# EAGLE design AC relay board (EAGLE 6.5.0)
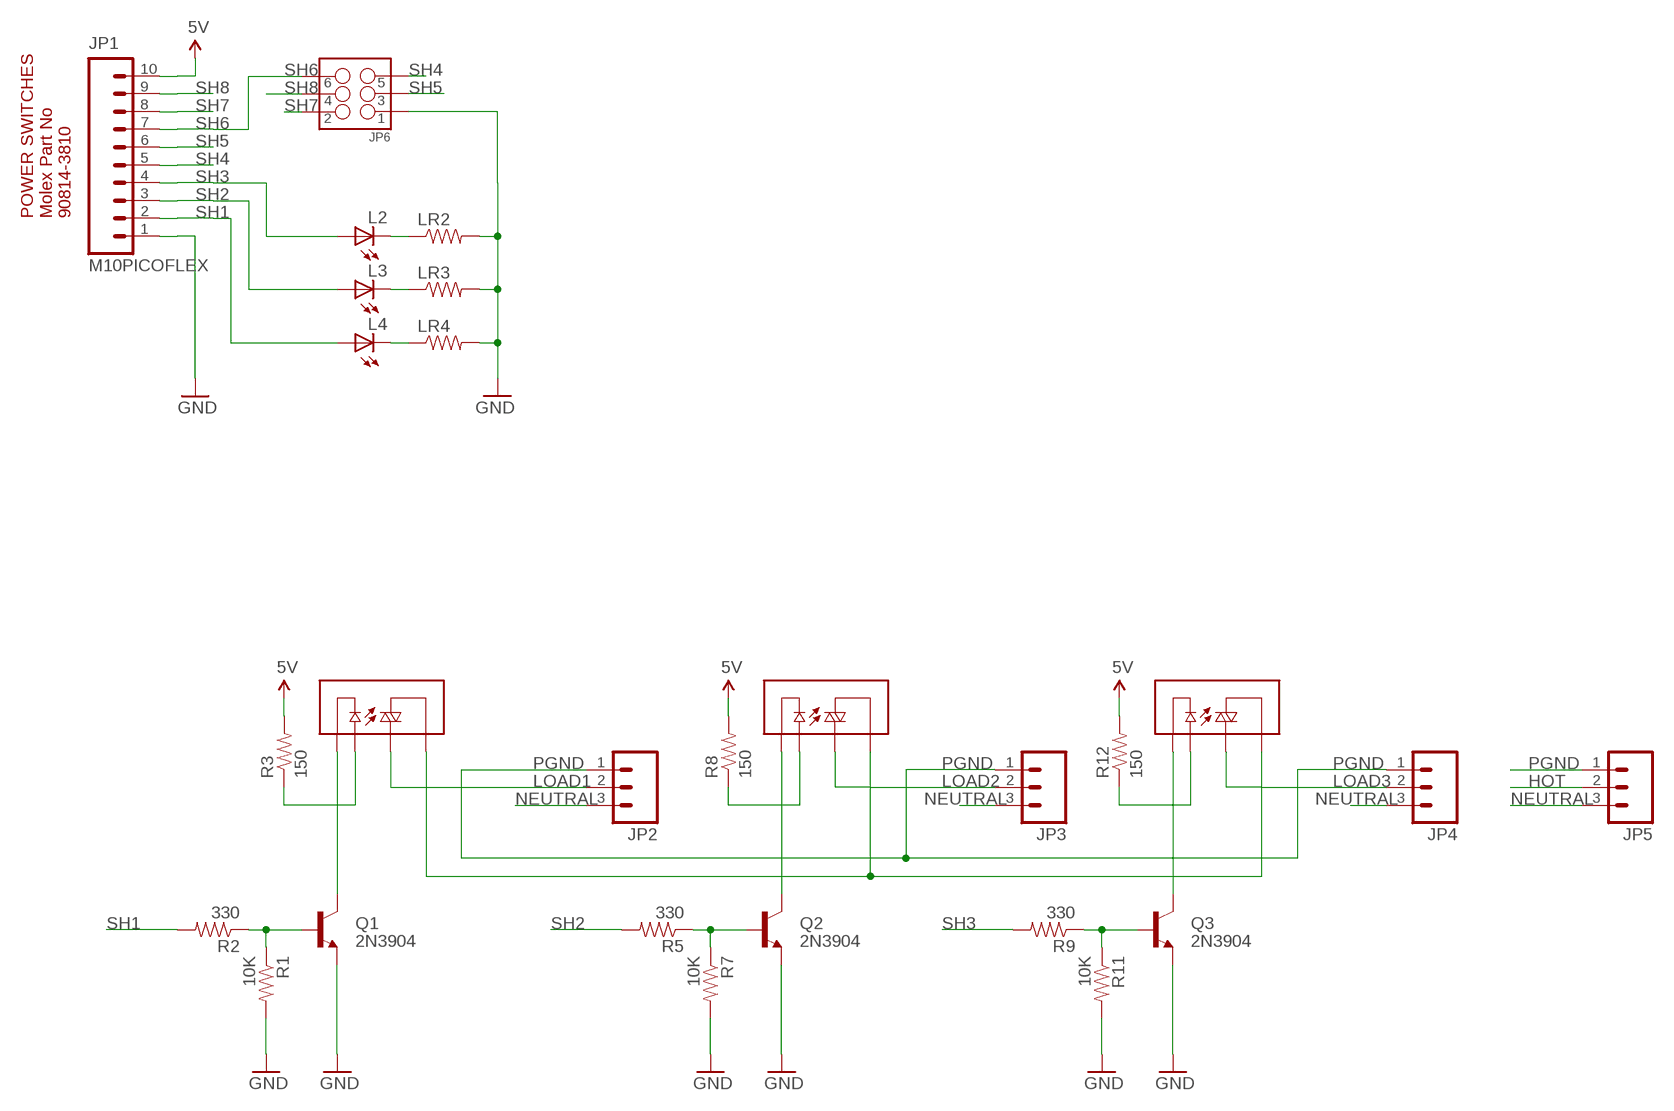
[diagram p0: schematic, sheet 1]

## Parts
JP1  M10PICOFLEX  [CONNECTOR_MOLEX_PICOFLEX_10]
JP2  M03SCREW_LOCK  [SCREWTERMINAL-3.5MM-3_LOCK.007S]
JP3  M03SCREW_LOCK  [SCREWTERMINAL-3.5MM-3_LOCK.007S]
JP4  M03SCREW_LOCK  [SCREWTERMINAL-3.5MM-3_LOCK.007S]
JP5  M03SCREW_LOCK  [SCREWTERMINAL-3.5MM-3_LOCK.007S]
JP6  M03X2NO_SILK  [2X3-NS]
L2  LED0805  [LED-0805]
L3  LED0805  [LED-0805]
L4  LED0805  [LED-0805]
LR2  RESISTOR0805-RES  [0805]
LR3  RESISTOR0805-RES  [0805]
LR4  RESISTOR0805-RES  [0805]
Q1  2N3904  TRANSISTOR_NPNSOT23  [SOT23]
Q2  2N3904  TRANSISTOR_NPNSOT23  [SOT23]
Q3  2N3904  TRANSISTOR_NPNSOT23  [SOT23]
R1  10K  RESISTOR0805-RES  [0805]
R2  330  RESISTOR0805-RES  [0805]
R3  150  RESISTOR0805-RES  [0805]
R5  330  RESISTOR0805-RES  [0805]
R7  10K  RESISTOR0805-RES  [0805]
R8  150  RESISTOR0805-RES  [0805]
R9  330  RESISTOR0805-RES  [0805]
R11  10K  RESISTOR0805-RES  [0805]
R12  150  RESISTOR0805-RES  [0805]
U1  S108T02  RELAY-SOLIDSTATENEWPTH  [RELAY-S202S01F]
U2  S108T02  RELAY-SOLIDSTATENEWPTH  [RELAY-S202S01F]
U3  S108T02  RELAY-SOLIDSTATENEWPTH  [RELAY-S202S01F]

## Nets
5V: JP1.10 R3.2 R8.2 R12.2
COIL: Q1.3(C) U1.4(-)
COIL1: Q2.3(C) U2.4(-)
COIL2: Q3.3(C) U3.4(-)
GND: JP1.1 JP6.1 LR2.2 LR3.2 LR4.2 Q1.2(E) Q2.2(E) Q3.2(E) R1.2 R7.2 R11.2
HOT: JP5.2 U1.2(T1) U2.2(T1) U3.2(T1)
LOAD1: JP2.2 U1.1(T2)
LOAD2: JP3.2 U2.1(T2)
LOAD3: JP4.2 U3.1(T2)
N$1: R3.1 U1.3(+)
N$2: Q2.1(B) R5.1 R7.1
N$3: L4.C-(C) LR4.1
N$4: R8.1 U2.3(+)
N$5: Q3.1(B) R9.1 R11.1
N$6: Q1.1(B) R1.1 R2.1
N$7: L3.C-(C) LR3.1
N$8: R12.1 U3.3(+)
N$9: L2.C-(C) LR2.1
NEUTRAL: JP2.3 JP3.3 JP4.3 JP5.3
PGND: JP2.1 JP3.1 JP4.1 JP5.1
SH1: JP1.2 L4.A+(A) R2.2
SH2: JP1.3 L3.A+(A) R5.2
SH3: JP1.4 L2.A+(A) R9.2
SH4: JP1.5 JP6.5
SH5: JP1.6 JP6.3
SH6: JP1.7 JP6.6
SH7: JP1.8 JP6.2
SH8: JP1.9 JP6.4

## Notes on the sheet
- POWER SWITCHES
  Molex Part No
  90814-3810

## Library data of the parts
JP1 = 2. ee_projects:M10: Header 10 Standard 10-pin 0.1" header. Use with straight break away headers (SKU : PRT-00116), right angle break away headers (PRT-00553), swiss pins (PRT-00743), machine pins (PRT-00117), and female headers (PRT-00115).
JP2-JP5 = 10.SparkFun:M03: Header 3 Standard 3-pin 0.1" header. Use with straight break away headers (SKU : PRT-00116), right angle break away headers (PRT-00553), swiss pins (PRT-00743), machine pins (PRT-00117), and female headers (PRT-00115). Molex polarized connector foot print use with SKU : PRT-08232 with associated crimp pins and housings.
JP6 = 12.ee_projects:M03X2: 2x3 .1" header. Shrouded, with keying- CONN-10681 SMT- CONN-11415 Pogo pins- HW-11044
L2-L4 = 2. ee_projects:LED
LR2-LR4 = SparkFun:RESISTOR: Resistor Basic schematic elements and footprints for 0603, 1206, and PTH resistors.
Q1-Q3 = 11.SparkFun:TRANSISTOR_NPN: Transistor NPN BJT configuration in SOT23 package. MMBT2222 is the common NPN we use. Double check BCE configuration again layout.
R1-R3 R5 R7-R9 R11 R12 = 2. ee_projects:RESISTOR: Resistor Basic schematic elements and footprints for 0603, 1206, and PTH resistors.
U1-U3 = 2. ee_projects:RELAY-SOLIDSTATE

## Board
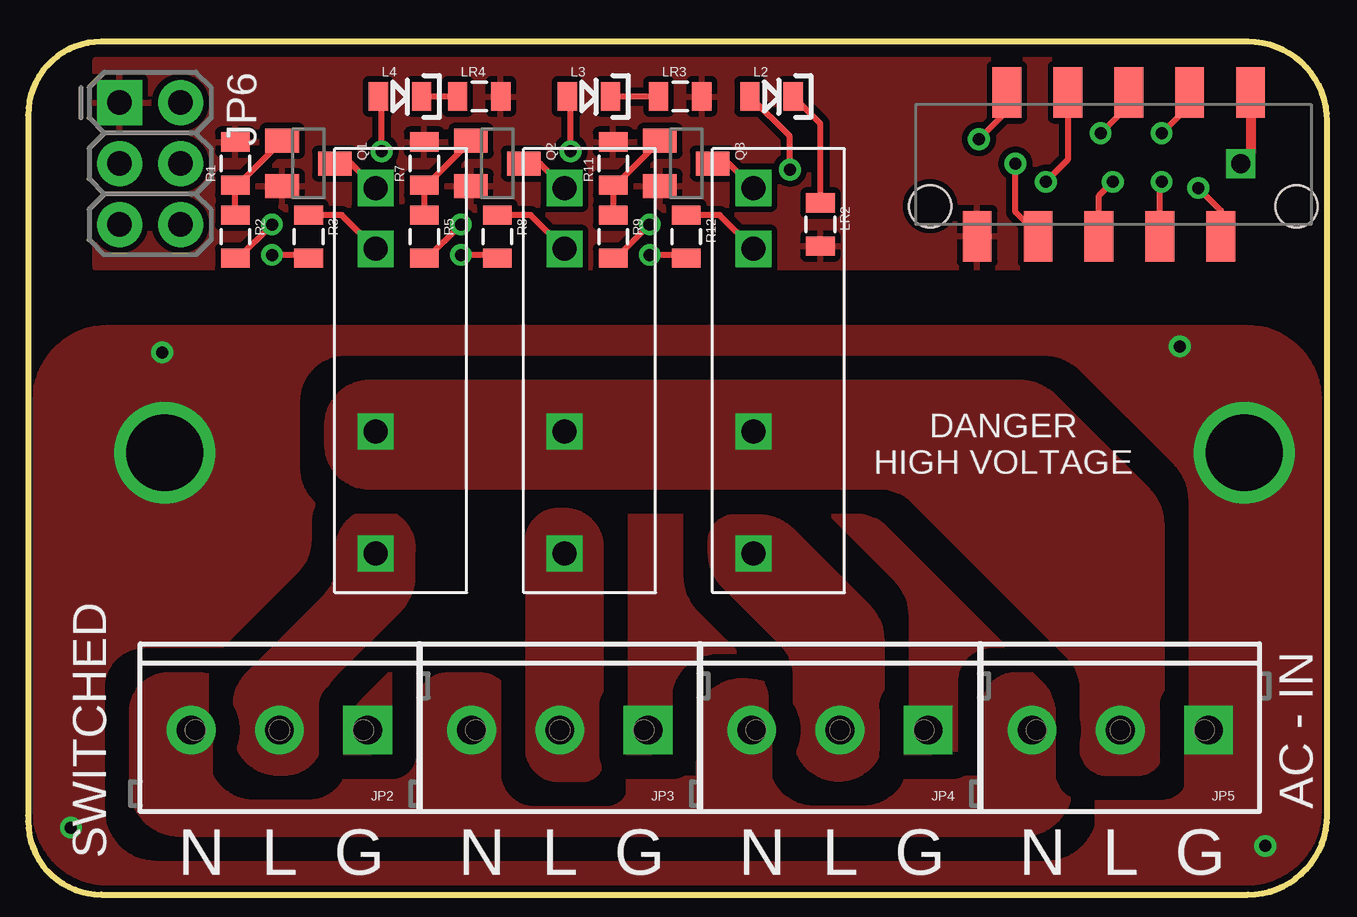
[diagram p1: board, top side]
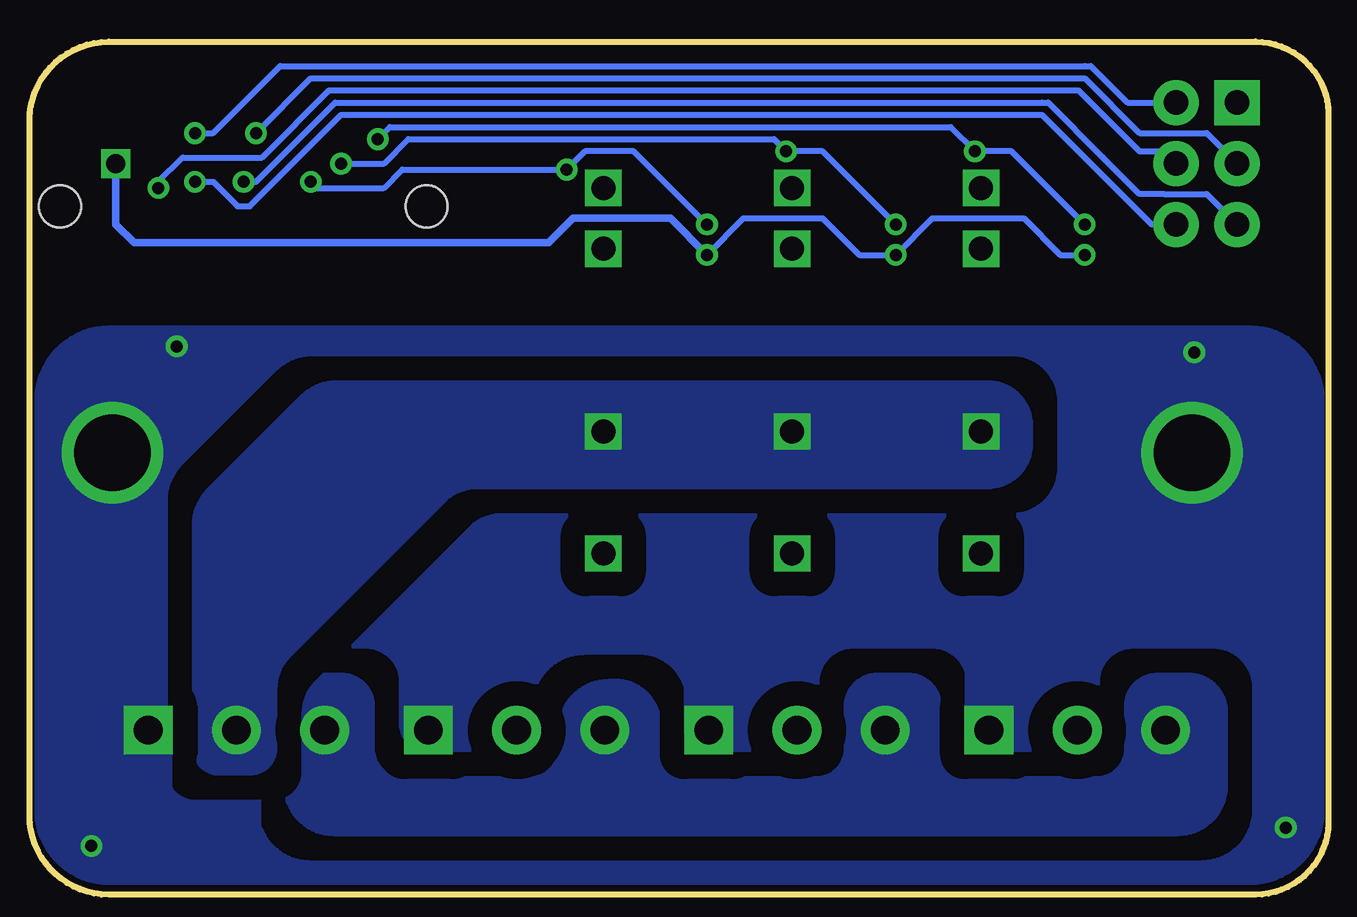
[diagram p2: board, bottom side, seen from below]

No outline drawn. Coordinates in mm, seen from the top.
Copper layers (1*16): Top 0.035mm / dielectric 1.5mm / Bottom 0.035mm
Design rules "default *": minimum track width 10mil, minimum drill 24mil, track to track 8mil, track to pad 8mil, pad to pad 8mil, via to via 8mil, smd to smd 8mil, copper to edge 10mil, drill to drill 8mil, minimum pad ring 10mil, minimum via ring 8mil, stop-mask expansion 4mil, vias tented up to drill 20mil, thermal gap 10mil
Milling: 9 lines

### Footprints (pad centres in the part's own frame; a part is rotated, then mirrored left to right if it is on the bottom)
CONNECTOR_MOLEX_PICOFLEX_10 = smd 1.2 x 2.1: 1 1.96,-1.25; 2 3.2,4.75; 3 4.5,-1.25; 4 5.74,4.75; 5 7.04,-1.25; 6 8.28,4.75; 7 9.58,-1.25; 8 10.82,4.75; 9 12.12,-1.25; 10 13.36,4.75 | hole 1.75: 0,0; 15.28,0
SCREWTERMINAL-3.5MM-3_LOCK.007S = drill 1.2 pad 2.032 square: 1 -0.178,0 | drill 1.2 pad 2.032: 2 3.5,0; 3 7.178,0
2X3-NS = drill 1.016 pad 1.88 square: 1 -2.54,-1.27 | drill 1.016 pad 1.88: 2 -2.54,1.27; 3 0,-1.27; 4 0,1.27; 5 2.54,-1.27; 6 2.54,1.27
LED-0805 = smd 0.8 x 1.2: A+ -0.9,0; C- 0.9,0
0805 = smd 0.8 x 1.2: 1 -0.9,0; 2 0.9,0
SOT23 = smd 1 x 1.4: 1 -0.95,-1.1; 2 0.95,-1.1; 3 0,1.1
RELAY-S202S01F = drill 1 square: 1 0,0; 2 5.08,0; 3 12.7,0; 4 15.24,0

### Placement (x,y rotation side)
JP1  44.7,49.28 0 top
JP2  21.08,27.43 180 top
JP3  32.77,27.43 180 top
JP4  44.45,27.43 180 top
JP5  56.13,27.43 180 top
JP6  12.19,51.05 270 top
L2  38.1,53.85 0 top
L3  30.48,53.85 0 top
L4  22.61,53.85 0 top
LR2  40.13,48.51 270 top
LR3  34.29,53.85 0 top
LR4  25.91,53.85 0 top
Q1  18.8,51.05 270 top
Q2  26.67,51.05 270 top
Q3  34.54,51.05 270 top
R1  15.75,51.05 90 top
R2  15.75,48.01 270 top
R3  18.8,48.01 270 top
R5  23.62,48.01 270 top
R7  23.62,51.05 90 top
R8  26.67,48.01 270 top
R9  31.5,48.01 270 top
R11  31.5,51.05 90 top
R12  34.54,48.01 270 top
U1  21.59,34.8 90 top
U2  29.46,34.8 90 top
U3  37.34,34.8 90 top

### Tracks (layer width: path | path; a pad name or v marks a point on that pad's centre or on a via)
5V  (via drill 0.5, 0.8)
  Top 0.254: R3.2 18.66,47.24 v17.27,47.24 | R8.2 26.53,47.24 v25.15,47.24 | R12.2 34.41,47.24 v33.02,47.24 | JP1.10 58.06,53.7
  Top 0.406: 58.06,53.7 58.06,51.46 v57.66,51.05
  Bottom 0.254: v33.02,47.24 31.5,48.77 28.19,48.77 26.67,47.24 v25.15,47.24 23.62,48.77 19.81,48.77 18.29,47.24 v17.27,47.24
  Bottom 0.305: v57.66,51.05 57.66,48.51 56.9,47.75 39.62,47.75 38.61,48.77 34.54,48.77 v33.02,47.24
COIL
  Top 0.254: U1.4 20.57,51.05 Q1.3
COIL1
  Top 0.254: U2.4 28.45,51.05 Q2.3
COIL2
  Top 0.254: U3.4 36.32,51.05 Q3.3
GND
  pour Top (isolate 0.254, rank 6): 9.91,46.74 60.71,46.74 60.71,55.37 9.91,55.37
  pour Top (isolate 0.254, rank 6): 9.91,46.74 60.71,46.74 60.71,55.37 9.91,55.37
HOT
  pour Top (isolate 1.016, no thermals): 51.05,29.14 51.05,26.67 arc90 52.07,25.65 53.34,25.65 arc90 54.36,26.67 54.36,36 arc45 53.77,37.42 49.86,41.32 arc45 48.45,41.91 21.34,41.91 arc90 19.56,40.13 19.56,39.37 arc90 21.34,37.59 42.61,37.59 arc-45 44.02,37.01 50.47,30.56 arc-45
  pour Bottom (isolate 1.016, no thermals): 51.05,29.14 51.05,26.67 arc90 52.07,25.65 53.34,25.65 arc90 54.36,26.67 54.36,36 arc45 53.77,37.42 49.86,41.32 arc45 48.45,41.91 21.34,41.91 arc90 19.56,40.13 19.56,39.37 arc90 21.34,37.59 42.61,37.59 arc-45 44.02,37.01 50.47,30.56 arc-45
LOAD1
  pour Top (isolate 1.016, rank 3, no thermals): 23.11,34.8 23.11,33.85 arc-45 22.53,32.43 19.89,29.8 arc45 19.3,28.38 19.3,27.18 arc-90 17.78,25.65 17.53,25.65 arc-90 15.75,27.43 15.75,28.38 arc-45 16.33,29.8 19.48,32.94 arc45 20.07,34.36 20.07,35.05 arc-90 21.59,36.58 arc-99
LOAD2
  pour Top (isolate 1.016, no thermals): 29.21,25.4 30.23,25.4 arc90 30.99,26.16 30.99,35.05 arc90 29.46,36.58 29.21,36.58 arc90 27.94,35.31 27.94,26.67 arc90
LOAD3
  pour Top (isolate 1.016, no thermals): 36.58,36.32 37.53,36.32 arc-45 38.94,35.74 42.09,32.59 arc-45 42.67,31.18 42.67,27.18 arc-90 40.89,25.4 arc-98 39.12,27.43 39.12,29.65 arc45 38.53,31.07 36.15,33.45 arc-45 35.56,34.86 35.56,35.31 arc-90
N$1
  Top 0.254: U1.3 20.18,48.91 R3.1
N$2
  Top 0.254: Q2.1 23.72,50.15 R7.1 R5.1
N$3
  Top 0.254: LR4.1 L4.C-
N$4
  Top 0.254: U2.3 28.06,48.91 R8.1
N$5
  Top 0.254: Q3.1 31.59,50.15 R11.1 R9.1
N$6
  Top 0.254: Q1.1 15.85,50.15 R1.1 R2.1
N$7
  Top 0.254: LR3.1 L3.C-
N$8
  Top 0.254: U3.3 35.93,48.91 R12.1
N$9
  Top 0.254: LR2.1 40.13,52.72 L2.C-
NEUTRAL
  pour Top (isolate 1.016, rank 5, no thermals): 11.43,28.19 11.43,25.11 arc90 13.43,23.11 48.55,23.11 arc90 50.55,25.11 50.55,28.7 arc90 49.53,29.72 48.26,29.72 arc90 46.99,28.45 46.99,25.4 39.12,25.4 39.12,27.43 arc90 37.08,29.46 36.83,29.46 arc90 35.05,27.69 35.05,25.4 27.18,25.4 27.18,28.45 arc90 25.91,29.72 24.64,29.72 arc90 23.37,28.45 23.37,26.42 arc-90 22.35,25.4 16.76,25.4 arc-90 15.49,26.67 15.49,28.45 arc90 14.22,29.72 12.95,29.72 arc90
  pour Bottom (isolate 1.016, rank 5, no thermals): 11.43,28.19 11.43,25.11 arc90 13.43,23.11 48.55,23.11 arc90 50.55,25.11 50.55,28.7 arc90 49.53,29.72 48.26,29.72 arc90 46.99,28.45 46.99,26.67 arc-90 45.72,25.4 40.39,25.4 arc-90 39.12,26.67 39.12,27.43 arc90 37.08,29.46 36.83,29.46 arc90 35.05,27.69 35.05,26.67 arc-90 33.78,25.4 28.45,25.4 arc-90 27.18,26.67 27.18,28.45 arc90 25.91,29.72 24.64,29.72 arc90 23.37,28.45 23.37,26.42 arc-90 22.35,25.4 16.76,25.4 arc-90 15.49,26.67 15.49,28.45 arc90 14.22,29.72 12.95,29.72 arc90
PGND  (via drill 0.5, 3.2)
  other vias: 12.7,43.18 8.89,23.37 58.67,22.61 55.12,43.43 57.8,39 12.8,39
  pour Top (isolate 1.016, rank 6, no thermals): 57.92,44.2 10.41,44.2 arc90 7.41,41.2 7.41,24.08 arc90 10.41,21.08 57.92,21.08 arc90 60.92,24.08 60.92,41.2 arc90
  pour Bottom (isolate 1.016, rank 6, no thermals): 57.92,44.2 10.41,44.2 arc90 7.41,41.2 7.41,24.08 arc90 10.41,21.08 57.92,21.08 arc90 60.92,24.08 60.92,41.2 arc90
SH1  (via drill 0.5)
  Top 0.254: R2.2 15.86,47.11 v17.27,48.51 | v21.84,51.56 21.84,53.71 L4.A+ | JP1.2 47.9,53.24 v46.74,52.07
  Bottom 0.254: v17.27,48.51 20.32,51.56 v21.84,51.56 22.86,52.58 46.23,52.58 v46.74,52.07
SH2  (via drill 0.5)
  Top 0.254: R5.2 23.74,47.11 v25.15,48.51 | v29.72,51.56 29.72,53.71 L3.A+ | JP1.3 49.2,48.08 48.26,49.02 v48.26,51.05
  Bottom 0.254: v25.15,48.51 28.19,51.56 v29.72,51.56 30.23,52.07 45.47,52.07 46.48,51.05 v48.26,51.05
SH3  (via drill 0.5)
  Top 0.254: R9.2 31.61,47.11 v33.02,48.51 | v38.86,50.8 38.86,52.19 L2.A+ | JP1.4 50.44,51.21 v49.53,50.29
  Bottom 0.254: v33.02,48.51 36.07,51.56 38.1,51.56 v38.86,50.8 45.72,50.8 46.48,50.04 49.28,50.04 v49.53,50.29
SH4  (via drill 0.5)
  Top 0.254: JP1.5 51.74,49.71 v52.32,50.29
  Bottom 0.254: v52.32,50.29 51.82,50.29 48.51,53.59 19.05,53.59 18.8,53.59 16.51,51.31 14.99,49.78 13.97,49.78 12.19,49.78 JP6.5
SH5  (via drill 0.5)
  Top 0.254: JP1.6 52.98,53.49 v51.82,52.32
  Bottom 0.254: v51.82,52.32 49.53,54.61 17.53,54.61 17.27,54.61 14.99,52.32 12.19,52.32 JP6.3
SH6  (via drill 0.5)
  Top 0.254: JP1.7 54.28,50.22 v54.36,50.29
  Bottom 0.254: v54.36,50.29 53.85,50.29 53.59,50.29 52.83,49.53 52.58,49.28 52.07,49.28 48.26,53.09 19.05,53.09 14.48,48.51 JP6.6
SH7  (via drill 0.5)
  Top 0.254: JP1.8 55.52,53.49 v54.36,52.32
  Bottom 0.254: v54.36,52.32 53.59,52.32 50.8,55.12 17.27,55.12 17.02,55.12 15.49,53.59 JP6.2
SH8  (via drill 0.5)
  Top 0.254: JP1.9 56.82,49.09 v55.88,50.04
  Bottom 0.254: v55.88,50.04 55.88,50.29 54.86,51.31 51.56,51.31 48.77,54.1 17.78,54.1 17.53,54.1 14.99,51.56 13.97,51.56 JP6.4

### Text on the board
tPlace: DANGER / HIGH VOLTAGE | SWITCHED | AC - IN | N L G | N L G | N L G | N L G